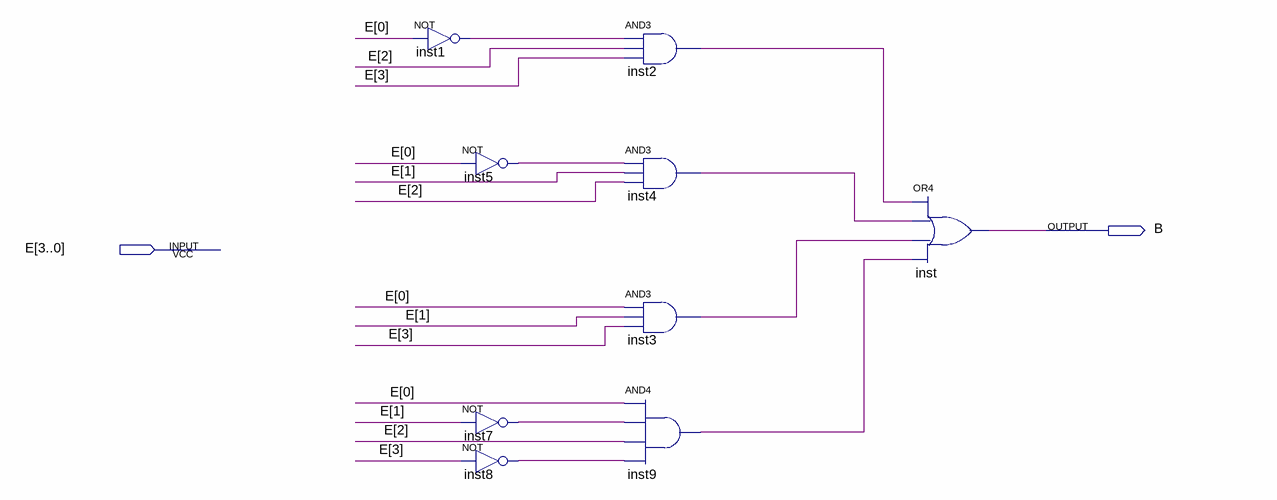
[diagram p0: schematic sheet]
// Quartus schematic seg_B.bdf as structural Verilog: 9 symbols, 2 pins
module seg_B (
  input  [3:0] E,
  output B
);

  wire inst1_out, inst2_out, inst3_out, inst4_out, inst5_out, inst7_out, inst8_out, inst9_out;

  not inst1 (inst1_out, E[0]);
  not inst5 (inst5_out, E[0]);
  not inst7 (inst7_out, E[1]);
  not inst8 (inst8_out, E[3]);
  and inst2 (inst2_out, inst1_out, E[2], E[3]);
  and inst4 (inst4_out, inst5_out, E[1], E[2]);
  and inst3 (inst3_out, E[0], E[1], E[3]);
  and inst9 (inst9_out, E[0], inst7_out, E[2], inst8_out);
  or inst (B, inst2_out, inst4_out, inst3_out, inst9_out);
endmodule
